# EAGLE design Buttons (EAGLE 6.6.0)
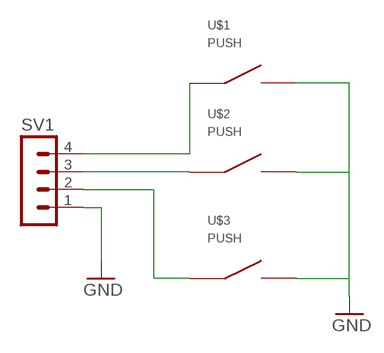
[diagram p0: schematic, sheet 1]

## Parts
SV1  MA04-1W  [MA04-1W]
U$1  PUSH  [PUSH]
U$2  PUSH  [PUSH]
U$3  PUSH  [PUSH]

## Nets
GND: SV1.1 U$1.3 U$1.4 U$2.3 U$2.4 U$3.3 U$3.4
N$1: SV1.2 U$3.1 U$3.2
N$2: SV1.3 U$2.1 U$2.2
N$3: SV1.4 U$1.1 U$1.2

## Library data of the parts
SV1 = SuperFeed:MA04-1W: PIN HEADER
U$1-U$3 = SuperFeed:PUSH

## Board
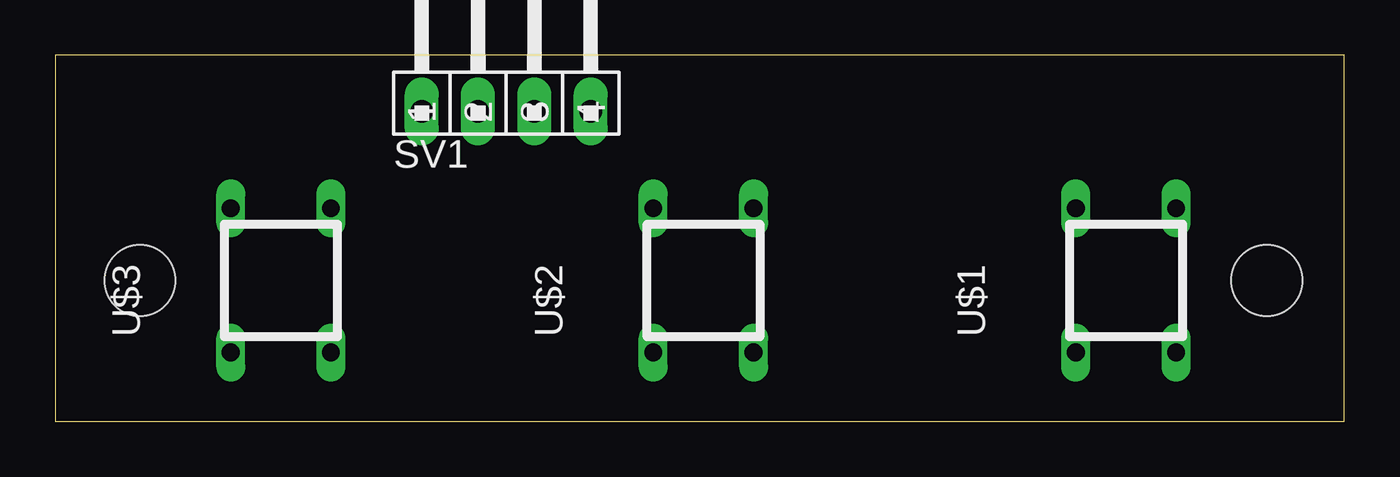
[diagram p1: board, top side]
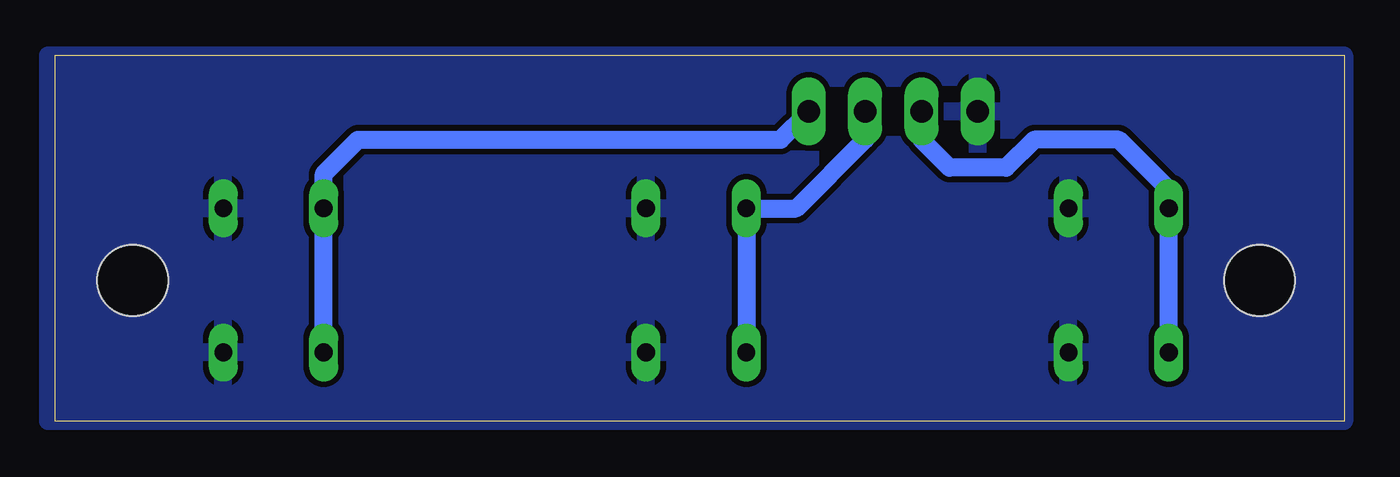
[diagram p2: board, bottom side, seen from below]

Size 58.09 x 16.5 mm. Coordinates in mm from the lower left corner, seen from the top.
Outline: 0,0 58.09,0 58.09,16.5 0,16.5 0,0
Copper layers (1*16): Top 0.035mm / dielectric 1.5mm / Bottom 0.035mm
Design rules "SuperFeed *": minimum track width 16mil, minimum drill 24mil, track to track 10mil, track to pad 10mil, pad to pad 10mil, via to via 10mil, smd to smd 10mil, copper to edge 0mil, drill to drill 10mil, minimum pad ring 10mil, minimum via ring 8mil, stop-mask expansion 4mil, vias tented up to drill 0mil, thermal gap 10mil
Holes 3.17 mm at 3.81,6.35 54.61,6.35

### Footprints (pad centres in the part's own frame; a part is rotated, then mirrored left to right if it is on the bottom)
MA04-1W = drill 1.016 long: 1 -3.81,0; 2 -1.27,0; 3 1.27,0; 4 3.81,0
PUSH = drill 0.8 long: 1 -3.251,2.261; 2 3.251,2.261; 3 -3.251,-2.261; 4 3.251,-2.261

### Placement (x,y rotation side)
SV1  20.32,13.97 0 top
U$1  48.26,6.35 90 top
U$2  29.21,6.35 90 top
U$3  10.16,6.35 90 top

### Tracks (layer width: path | path; a pad name or v marks a point on that pad's centre or on a via)
GND
  pour Bottom: 0,0 58.42,0 58.42,16.51 0,16.51
N$1
  Bottom 0.813: U$3.1 U$3.2 7.9,10.44 10.16,12.7 13.97,12.7 15.24,11.43 17.78,11.43 19.05,12.7 SV1.2
N$2
  Bottom 0.813: SV1.3 21.59,12.7 24.69,9.6 U$2.2 U$2.1
N$3
  Bottom 0.813: U$1.1 U$1.2 46,11.15 44.45,12.7 25.4,12.7 SV1.4